# Altium schematic sheet E17-04-TSMS.SchDoc
size A; DocumentNumber: 14; SheetNumber: 14; SheetTotal: 17
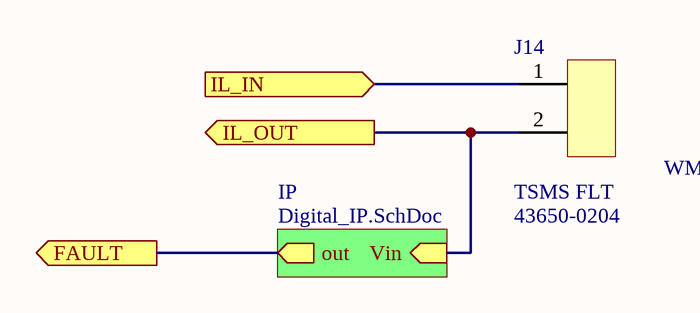
[diagram p0: E17-04-TSMS.SchDoc]

## Parts
J14  TSMS FLT  MPN: 43650-0204  [MOLEX_DURACLIK_2]

## Sub-sheets
IP = Digital_IP.SchDoc: Vin (in), out (out)

## Ports
FAULT (out), IL_IN (in), IL_OUT (out)

## Nets
FAULT: port FAULT, sheet IP/out
IL_IN: J14.1 ; port IL_IN
IL_OUT: J14.2 ; port IL_OUT, sheet IP/Vin

## Library data of the parts
J14 = J_5023520200: MOLEX DURACLIK 2-PIN RA; Supplier 1: Digi-Key; Supplier Part Number 1: 5023520201-ND; Digikey_PN: WM7169CT-ND; Supplier 2: Digi-Key; Supplier Part Number 2: WM7169DKR-ND